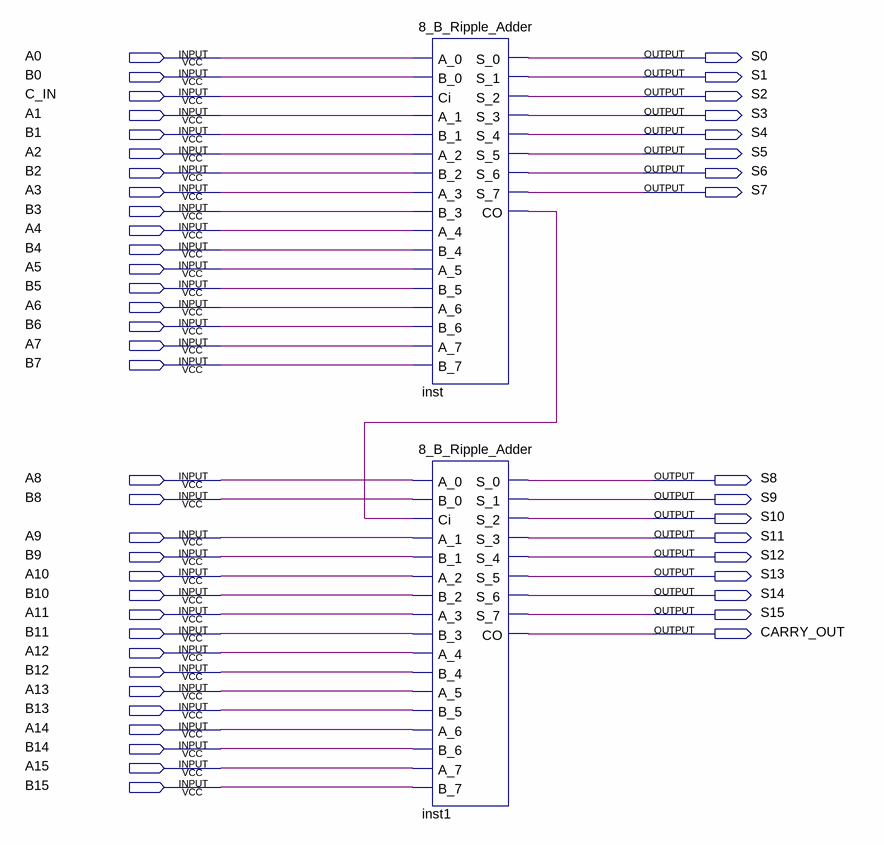
[diagram p0: schematic sheet]
// Quartus schematic 16_B_RIPPLE_ADDER.bdf as structural Verilog: 2 symbols, 50 pins
module \16_B_RIPPLE_ADDER  (
  input  A0,
  input  B0,
  input  C_IN,
  input  A1,
  input  B1,
  input  A2,
  input  B2,
  input  A3,
  input  B3,
  input  A4,
  input  B4,
  input  A5,
  input  B5,
  input  A6,
  input  B6,
  input  A7,
  input  B7,
  input  A8,
  input  B8,
  input  A9,
  input  B9,
  input  A10,
  input  B10,
  input  A11,
  input  B11,
  input  A12,
  input  B12,
  input  A13,
  input  B13,
  input  A14,
  input  B14,
  input  A15,
  input  B15,
  output S0,
  output S1,
  output S2,
  output S3,
  output S4,
  output S5,
  output S6,
  output S7,
  output S8,
  output S9,
  output S10,
  output S11,
  output S12,
  output S13,
  output S14,
  output S15,
  output CARRY_OUT
);

  wire inst_co;

  \8_B_Ripple_Adder  inst (
    .A_0(A0), .B_0(B0), .Ci(C_IN), .A_1(A1), .B_1(B1), .A_2(A2), .B_2(B2), .A_3(A3), .B_3(B3), .A_4(A4),
    .B_4(B4), .A_5(A5), .B_5(B5), .A_6(A6), .B_6(B6), .A_7(A7), .B_7(B7), .S_0(S0), .S_1(S1), .S_2(S2),
    .S_3(S3), .S_4(S4), .S_5(S5), .S_6(S6), .S_7(S7), .CO(inst_co));
  \8_B_Ripple_Adder  inst1 (
    .A_0(A8), .B_0(B8), .Ci(inst_co), .A_1(A9), .B_1(B9), .A_2(A10), .B_2(B10), .A_3(A11), .B_3(B11),
    .A_4(A12), .B_4(B12), .A_5(A13), .B_5(B13), .A_6(A14), .B_6(B14), .A_7(A15), .B_7(B15), .S_0(S8),
    .S_1(S9), .S_2(S10), .S_3(S11), .S_4(S12), .S_5(S13), .S_6(S14), .S_7(S15), .CO(CARRY_OUT));
endmodule
